# EasyEDA Pro project PCB_v3.3.epro

# Schematic ball_wireless_v3.3
Board Name: ball_wireless_v3.3; Create Date: 2025-08-07; Page Name: Sch; Project Name: CNC_Wireless; Schematic Name: ball_wireless_v3.3; Update Date: 2025-08-07; Company: UTL Lab; Drawn: Long Jun, Chiou; Page Size: A4; Version: v3.3
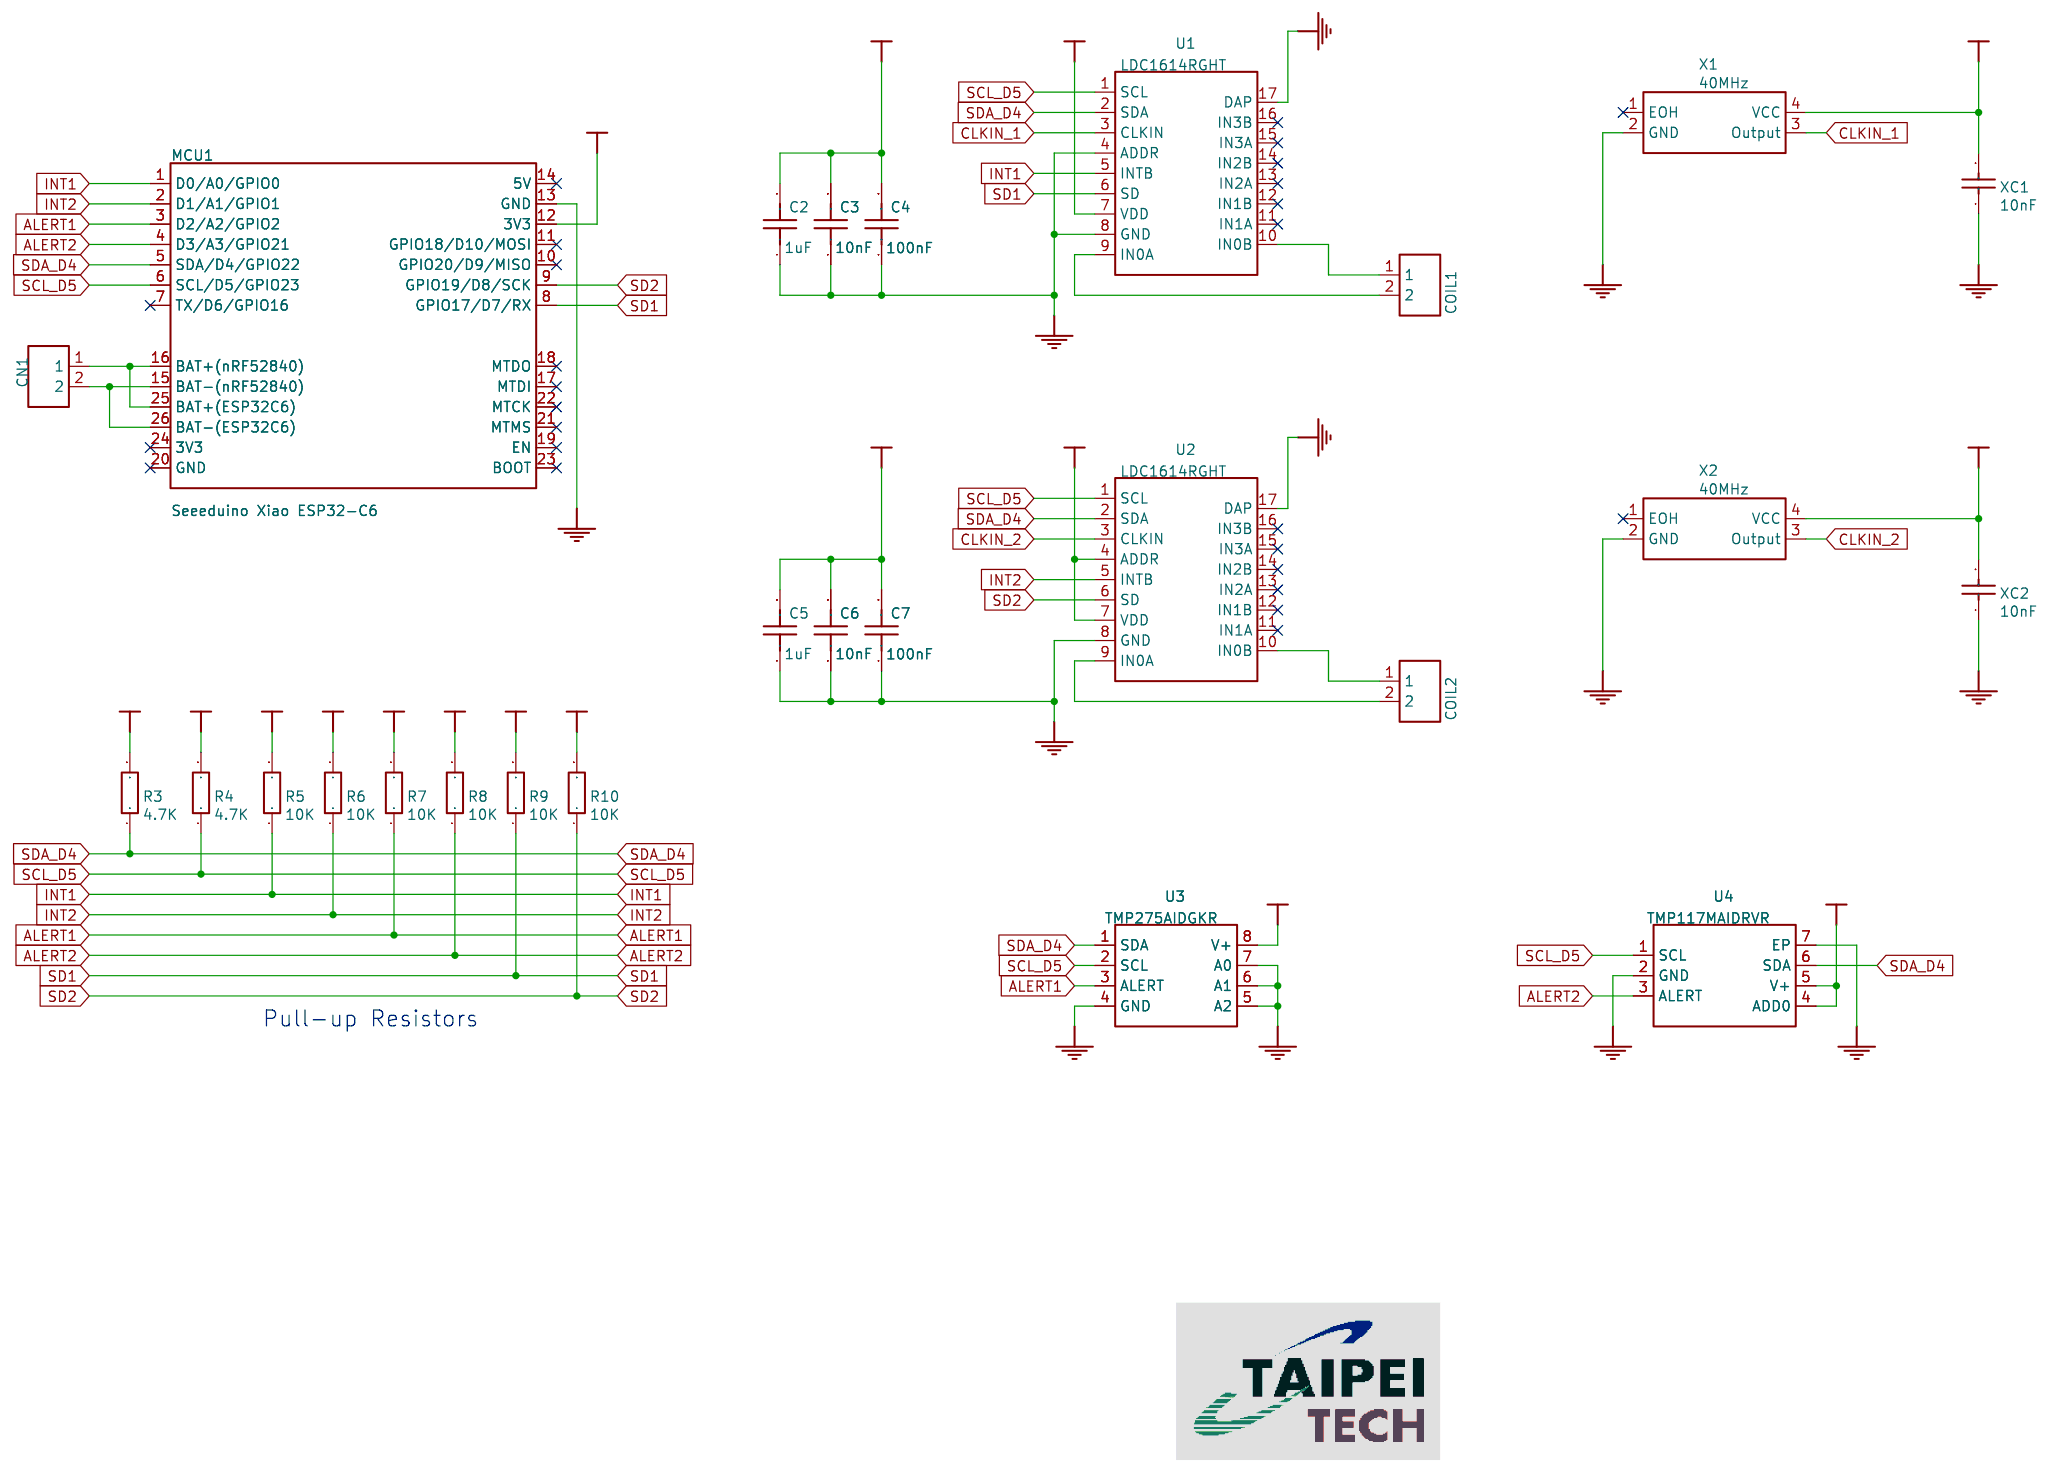
[diagram p0: schematic sheet]

## Parts
C2  1uF  [C0603]
C3  10nF  [C0603]
C4  100nF  [C0603]
C5  1uF  [C0603]
C6  10nF  [C0603]
C7  100nF  [C0603]
CN1  PH2.0-2P  [CONN-TH_PH-2A]
COIL1  UTL_COIL_2  [UTL_CNC_COIL_2]
COIL2  UTL_COIL_2  [UTL_CNC_COIL_2]
MCU1  Seeeduino Xiao ESP32-C6  [SEEEDUINO XIAO ESP32C6/NRF52840(Special)]
R3  4.7K  [R0603]
R4  4.7K  [R0603]
R5  10K  [R0603]
R6  10K  [R0603]
R7  10K  [R0603]
R8  10K  [R0603]
R9  10K  [R0603]
R10  10K  [R0603]
U1  LDC1614RGHT  [WQFN-16_L4.0-W4.0-P0.50-BL-EP2.6]
U2  LDC1614RGHT  [WQFN-16_L4.0-W4.0-P0.50-BL-EP2.6]
U3  TMP275AIDGKR  [VSSOP-8_L3.0-W3.0-P0.65-LS5.0-BL]
U4  TMP117MAIDRVR  [WSON-6_L2.0-W2.0-P0.65-BL-EP]
X1  40MHz  [OSC-SMD_4P-L2.5-W2.0-BL]
X2  40MHz  [OSC-SMD_4P-L2.5-W2.0-BL]
XC1  10nF  [C0603]
XC2  10nF  [C0603]

## Library data of the parts
C2 C5 = 1uF: Supplier: LCSC; Supplier Part: C913754; Manufacturer: muRata(村田); Manufacturer Part: GCM188R11H104KA42D; JLCPCB Part Class: Extended Part; Contributor: LCSC; nameAlias: Value; spicePre: C; spiceSymbolName: GCM188R11H104KA42D
C3 C6 = 10nF: Supplier: LCSC; Supplier Part: C913754; Manufacturer: muRata(村田); Manufacturer Part: GCM188R11H104KA42D; JLCPCB Part Class: Extended Part; Contributor: LCSC; nameAlias: Value; spicePre: C; spiceSymbolName: GCM188R11H104KA42D
C4 C7 = 100nF: Supplier: LCSC; Supplier Part: C913754; Manufacturer: muRata(村田); Manufacturer Part: GCM188R11H104KA42D; JLCPCB Part Class: Extended Part; Contributor: LCSC; nameAlias: Value; spicePre: C; spiceSymbolName: GCM188R11H104KA42D
CN1 = PH2.0-2P: Supplier: LCSC; Supplier Part: C722767; Manufacturer: CAX(创都); Manufacturer Part: PH-2A; JLCPCB Part Class: Extended Part; link: https://lcsc.com/eda_search?q=C722767&%26type=1&ref=editor; Contributor: LCSC; spicePre: C; spiceSymbolName: PH-2A_C722767
COIL1 COIL2 = UTL_COIL_2: Supplier: UTL; Contributor: sunnyair; spicePre: C
MCU1 = Seeeduino Xiao ESP32-C6: Manufacturer: Seeedstudio
R3 R4 = 4.7K: Supplier: LCSC; Manufacturer: YAGEO(国巨); Manufacturer Part: RC0603FR-0710KL; Supplier Part: C98220; JLCPCB Part Class: Extended Part; nameAlias: Value; spicePre: R; spiceSymbolName: RC0603FR-0710KL
R5-R10 = 10K: Supplier: LCSC; Manufacturer: YAGEO(国巨); Manufacturer Part: RC0603FR-0710KL; Supplier Part: C98220; JLCPCB Part Class: Extended Part; nameAlias: Value; spicePre: R; spiceSymbolName: RC0603FR-0710KL
U1 U2 = LDC1614RGHT: Supplier: LCSC; Supplier Part: C2667274; Manufacturer: TI; JLCPCB Part Class: Extended Part; Contributor: sunnyair; spicePre: U
U3 = TMP275AIDGKR: Supplier: LCSC; Supplier Part: C2876440; Manufacturer: null; JLCPCB Part Class: Extended Part; Contributor: LCSC; spicePre: U
U4 = TMP117MAIDRVR: Supplier: Mouser; Supplier Part: 595-TMP117MAIDRVR; Manufacturer: TI(德州仪器); JLCPCB Part Class: Extended Part; Contributor: sunnyair; spicePre: U
X1 X2 = 40MHz: Supplier: LCSC; Supplier Part: C1990951; Manufacturer: CTS(西迪斯); Manufacturer Part: CA25C4005ILT; JLCPCB Part Class: Extended Part; Contributor: lcsc; nameAlias: Value; spicePre: U; spiceSymbolName: CA25C4005ILT
XC1 XC2 = 10nF: Supplier: LCSC; Manufacturer: YAGEO(国巨); Manufacturer Part: CC0603KRX7R9BB103; Supplier Part: C100042; JLCPCB Part Class: Extended Part; nameAlias: Value; spicePre: C; spiceSymbolName: CC0603KRX7R9BB103

## Nets
GND: C2.1 C3.1 C4.1 C5.1 C6.1 C7.1 MCU1.13(GND) U1.4(ADDR) U1.8(GND) U1.17(DAP) U2.8(GND) U2.17(DAP) U3.4(GND) U3.5(A2) U3.6(A1) U3.7(A0) U4.2(GND) U4.7(EP) X1.2(GND) X2.2(GND) XC1.1 XC2.1
VCC: C2.2 C3.2 C4.2 C5.2 C6.2 C7.2 MCU1.12(3V3) R3.2 R4.2 R5.2 R6.2 R7.2 R8.2 R9.2 R10.2 U1.7(VDD) U2.4(ADDR) U2.7(VDD) U3.8(V+) U4.4(ADD0) U4.5(V+) X1.4(VCC) X2.4(VCC) XC1.2 XC2.2
ALERT1: MCU1.3(D2/A2/GPIO2) R7.1 U3.3(ALERT)
ALERT2: MCU1.4(D3/A3/GPIO21) R8.1 U4.3(ALERT)
CLKIN_1: U1.3(CLKIN) X1.3(Output)
CLKIN_2: U2.3(CLKIN) X2.3(Output)
INT1: MCU1.1(D0/A0/GPIO0) R5.1 U1.5(INTB)
INT2: MCU1.2(D1/A1/GPIO1) R6.1 U2.5(INTB)
SCL_D5: MCU1.6(SCL/D5/GPIO23) R4.1 U1.1(SCL) U2.1(SCL) U3.2(SCL) U4.1(SCL)
SD1: MCU1.8(GPIO17/D7/RX) R9.1 U1.6(SD)
SD2: MCU1.9(GPIO19/D8/SCK) R10.1 U2.6(SD)
SDA_D4: MCU1.5(SDA/D4/GPIO22) R3.1 U1.2(SDA) U2.2(SDA) U3.1(SDA) U4.6(SDA)
$1N6: COIL1.2 U1.9(IN0A)
$1N7: COIL1.1 U1.10(IN0B)
$1N21: CN1.2 MCU1.15(BAT-(nRF52840)) MCU1.26(BAT-(ESP32C6))
$1N22: CN1.1 MCU1.16(BAT+(nRF52840)) MCU1.25(BAT+(ESP32C6))
$1N50: COIL2.1 U2.10(IN0B)
$1N51: COIL2.2 U2.9(IN0A)

Not connected (* = marked no-connect by the designer): MCU1 7(TX/D6/GPIO16)* 10(GPIO20/D9/MISO)* 11(GPIO18/D10/MOSI)* 14(5V)* 17(MTDI)* 18(MTDO)* 19(EN)* 20(GND)* 21(MTMS)* 22(MTCK)* 23(BOOT)* 24(3V3)*; U1 11(IN1A)* 12(IN1B)* 13(IN2A)* 14(IN2B)* 15(IN3A)* 16(IN3B)*; U2 11(IN1A)* 12(IN1B)* 13(IN2A)* 14(IN2B)* 15(IN3A)* 16(IN3B)*; X1 1(EOH)*; X2 1(EOH)*

## Notes on the sheet
- Pull-up Resistors

# Board PCB_v3.3
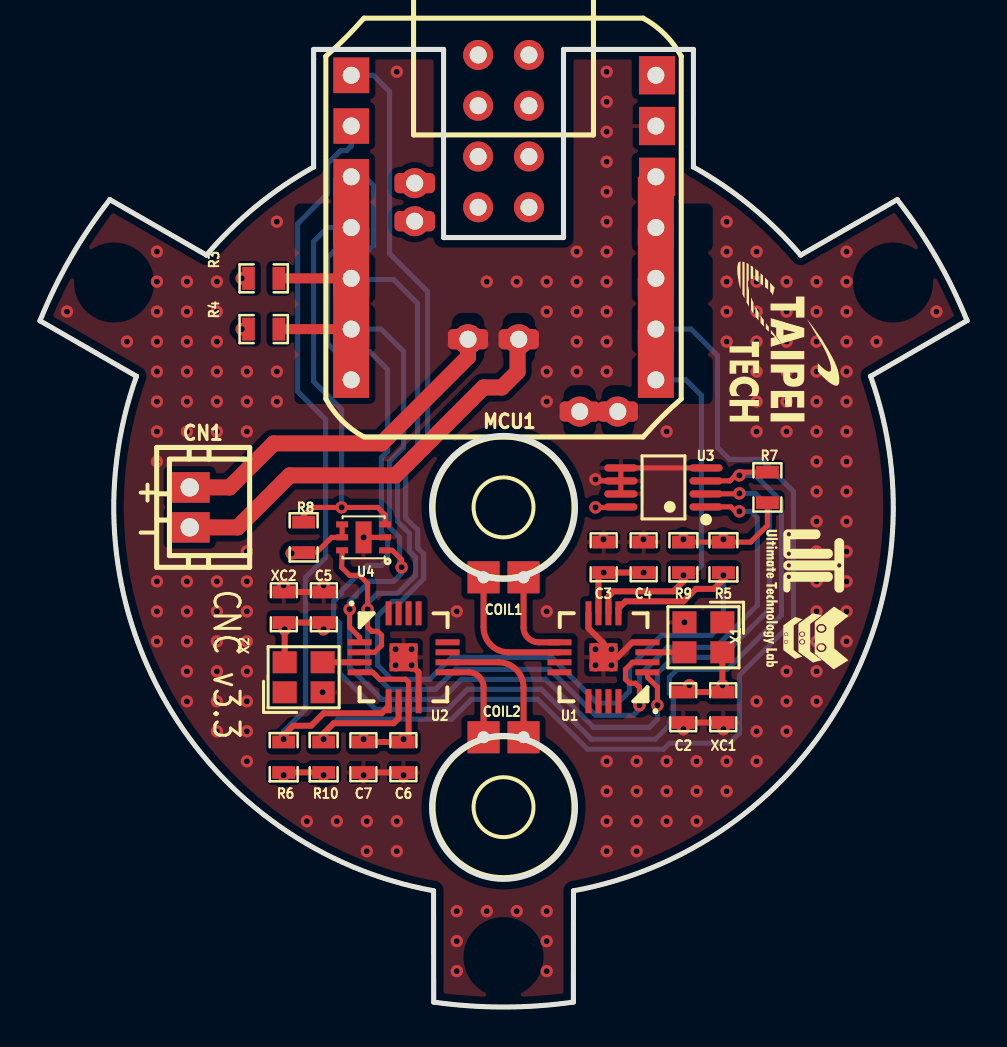
[diagram p1: board, top side]
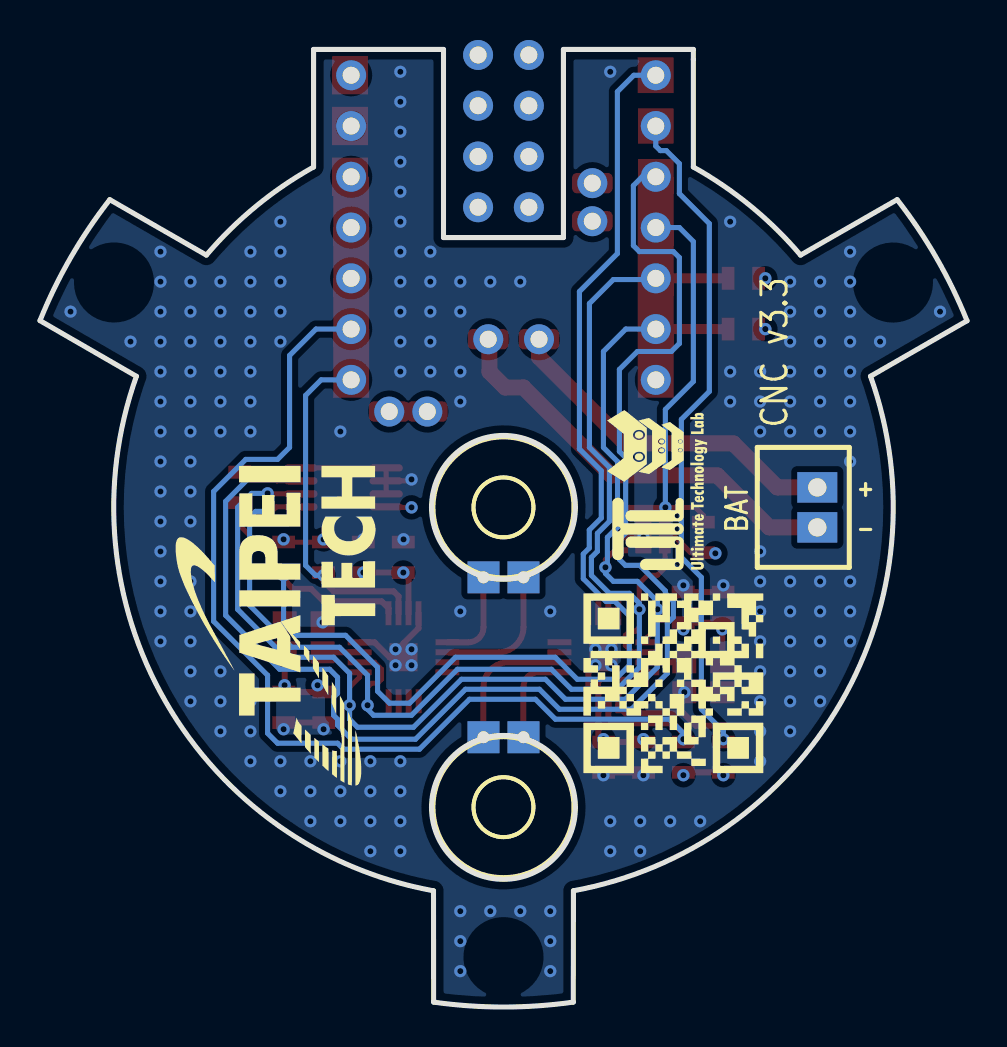
[diagram p2: board, bottom side, seen from below]

Outline 46.38 x 47.91 mm; copper layers: Top Layer, VCC, GND, Bottom Layer. Coordinates in mm from the lower left corner of the outline.
Outline path: circle c23.19,25 r3.6 ; circle c23.19,9.99 r3.6 ; 0,34.34 arc(1.53,37.49) 3.5,40.4 8.33,37.62 arc(10.81,40.07) 13.69,42.03 13.69,47.41 13.69,47.91 20.19,47.91 20.19,38.5 26.19,38.5 26.19,47.91 32.69,47.91 32.69,42.03 arc(35.57,40.07) 38.05,37.62 42.89,40.4 arc(44.85,37.49) 46.38,34.34 41.55,31.56 arc(40.08,15.25) 26.69,5.82 26.68,0.25 arc(23.19,0) 19.7,0.25 19.69,5.82 arc(6.3,15.25) 4.83,31.56 0,34.34
Stack: Top Layer 0.035mm / Dielectric1 0.48mm PP er 4.5 / VCC 0.035mm / Dielectric2 0.48mm FR4 er 4.5 / GND 0.035mm / Dielectric3 0.48mm PP er 4.5 / Bottom Layer 0.035mm

## Design rules (mm)
template: 用户自定义配置
spacing Default (default): track to track 0.152, other pairs 0 to 0.152
track width Default (default): min 0.254, default 0.254, max 25.4
differential pair differentialPair (default): width min 0.127, default 0.254, max 2.54; gap min 0.152, default 0.152
via Default (default): diameter min 0.61, default 0.61, max 100.025; hole min 0.305, default 0.305, max 59.995
pour e1 uses L3
pour e16 uses L2
pour e188 uses L1
pour e345 uses L4

## Placement (name value [footprint] x y rotation side)
C2  1uF  [C0603]  32.19 15 90 top
C3  10nF  [C0603]  28.19 22.5 270 top
C4  100nF  [C0603]  30.19 22.5 270 top
C5  1uF  [C0603]  14.19 20 270 top
C6  10nF  [C0603]  18.19 12.5 90 top
C7  100nF  [C0603]  16.19 12.5 90 top
CN1  PH2.0-2P  [CONN-TH_PH-2A]  7.49 25 270 top
COIL1  UTL_COIL_2  [UTL_CNC_COIL_2]  23.19 25 90 top
COIL2  UTL_COIL_2  [UTL_CNC_COIL_2]  23.19 10 270 top
MCU1  Seeeduino Xiao ESP32-C6  [SEEEDUINO XIAO ESP32C6/NRF52840(Special)]  23.19 39 0 top
R3  4.7K  [R0603]  11.19 36.46 180 top
R4  4.7K  [R0603]  11.19 33.92 180 top
R5  10K  [R0603]  34.19 22.5 90 top
R6  10K  [R0603]  12.19 12.5 270 top
R7  10K  [R0603]  36.39 26 270 top
R8  10K  [R0603]  13.19 23.5 270 top
R9  10K  [R0603]  32.19 22.5 90 top
R10  10K  [R0603]  14.19 12.5 270 top
U1  LDC1614RGHT  [WQFN-16_L4.0-W4.0-P0.50-BL-EP2.6]  28.19 17.5 90 top
U2  LDC1614RGHT  [WQFN-16_L4.0-W4.0-P0.50-BL-EP2.6]  18.19 17.5 270 top
U3  TMP275AIDGKR  [VSSOP-8_L3.0-W3.0-P0.65-LS5.0-BL]  31.19 26 90 top
U4  TMP117MAIDRVR  [WSON-6_L2.0-W2.0-P0.65-BL-EP]  16.19 23.5 90 top
X1  40MHz  [OSC-SMD_4P-L2.5-W2.0-BL]  33.19 18.5 180 top
X2  40MHz  [OSC-SMD_4P-L2.5-W2.0-BL]  13.19 16.5 0 top
XC1  10nF  [C0603]  34.19 15 90 top
XC2  10nF  [C0603]  12.19 20 270 top

## Footprints (pads in the part's own frame, mm; a bottom-side part is the same pattern mirrored in y, then rotated)
C0603
  custom 0.635x1.143 smd: 1(-0.764,0.01) 2(0.76,0.01)
CONN-TH_PH-2A
  rect 1.524x2 hole 0.914: 1(-1,0) 2(1,0)
OSC-SMD_4P-L2.5-W2.0-BL
  rect 1.2x1.1 smd: 1(-0.95,-0.75) 2(0.95,-0.75) 3(0.95,0.75) 4(-0.95,0.75)
R0603
  rect 0.635x1.143 smd: 1(-0.762,0)
  custom 0.635x1.143 smd: 2(0.762,0)
SEEEDUINO XIAO ESP32C6/NRF52840(Special)
  round 1.5 hole 0.85: 1(-7.62,7.62) 2(-7.62,5.08) 3(-7.62,2.54) 4(-7.62,0) 5(-7.62,-2.54) 6(-7.62,-5.08) 7(-7.62,-7.62) 8(7.62,-7.62) 9(7.62,-5.08) 10(7.62,-2.54) 11(7.62,0) 12(7.62,2.54) 13(7.62,5.08) 14(7.62,7.62) 15(-4.445,2.223) 16(-4.445,0.318) 17(-1.27,8.636) 18(1.27,8.636) 19(-1.27,6.096) 20(1.27,6.096) 21(-1.27,3.556) 22(1.27,3.556) 23(-1.27,1.016) 24(1.27,1.016) 25(-1.778,-5.588) 26(0.762,-5.588) 27(3.81,-9.207) 28(5.715,-9.207)
  custom 1.8x1.788 smd: 1(-7.614,7.62)
  custom 1.778x1.778 smd: 2(-7.62,5.08) 3(-7.62,2.54)
  custom 1.8x3.44 smd: 4(-7.62,0) 5(-7.62,-2.54) 6(-7.62,-5.08) 7(-7.62,-7.62) 8(7.62,-7.62) 9(7.62,-5.08) 10(7.62,-2.54) 11(7.62,0)
  custom 1.8x1.916 smd: 12(7.678,2.54)
  custom 1.8x1.915 smd: 13(7.678,5.08)
  custom 1.8x1.913 smd: 14(7.676,7.62)
  custom 2.032x1.016 smd: 15(-4.445,2.223) 16(-4.445,0.318) 25(-1.778,-5.588) 26(0.762,-5.588) 27(3.81,-9.207) 28(5.715,-9.207)
UTL_CNC_COIL_2
  rect 1.6x1.6 hole 0.6: 1(-3.5,1) 2(-3.5,-1)
VSSOP-8_L3.0-W3.0-P0.65-LS5.0-BL
  oval 0.364x1.662 smd: 1(-0.975,-2.131) 2(-0.325,-2.131) 3(0.325,-2.131) 4(0.975,-2.131) 5(0.975,2.131) 6(0.325,2.131) 7(-0.325,2.131) 8(-0.975,2.131)
WQFN-16_L4.0-W4.0-P0.50-BL-EP2.6
  rect 0.3x1.2 smd: 1(-0.75,-2.2) 2(-0.25,-2.2) 3(0.25,-2.2) 4(0.75,-2.2) 9(0.75,2.2) 10(0.25,2.2) 11(-0.25,2.2) 12(-0.75,2.2)
  rect 1.2x0.3 smd: 5(2.2,-0.75) 6(2.2,-0.25) 7(2.2,0.25) 8(2.2,0.75) 13(-2.2,0.75) 14(-2.2,0.25) 15(-2.2,-0.25) 16(-2.2,-0.75)
  rect 1.4x1.4 smd: 17(0,0)
WSON-6_L2.0-W2.0-P0.65-BL-EP
  rect 0.3x0.6 smd: 1(-0.65,-1.075) 2(0,-1.075) 3(0.65,-1.075) 4(0.65,1.075) 5(0,1.075) 6(-0.65,1.075)
  rect 1.6x0.8 smd: 7(0,0)

## Nets
As in the schematic.

Pads without a net: MCU1 7 10 11 14 17 18 19 20 21 22 23 24 27 28; U1 11 12 13 14 15 16; U2 11 12 13 14 15 16; X1 1; X2 1

## Via types
v1: diameter 0.61, hole 0.305, Top Layer to Bottom Layer, 161 vias
v2: diameter 0.62, hole 0.31, Top Layer to Bottom Layer, 49 vias

## Routing (per net, layer and track width the routed paths; a pad name or vN(x,y) marks a point on that pad's centre or on a via; arc(x,y) is an arc through that point)
GND: length 21.6
  Top Layer w0.254: U3.7 U3.6 ; U3.6 27.87,26.32 v2(27.79,26.4) ; U3.6 U3.5 U3.4 ; U4.2 v2(16.19,23.5)
  Top Layer w0.3: 18.19,11.6 18.19,11.74 C7.1 ; C2.1 XC1.1 ; U2.17 v2(18.59,17.1) 18.94,16.75 U2.8 ; 30.39,18.25 29.64,18.25 28.89,17.5 28.19,17.5 28.19,18.2 27.44,18.95 U1.8 ; XC2.1 C5.1
  vias: v1(1.35,34.8) v1(4.35,33.3) v1(5.85,37.8) v1(5.85,36.3) v1(5.85,34.8) v1(5.85,33.3) v1(5.85,31.8) v1(5.85,30.3) v1(5.85,28.8) v1(5.85,27.3) v1(5.85,21.3) v1(5.85,19.8) v1(5.85,18.3) v1(7.35,36.3) v1(7.35,34.8) v1(7.35,33.3) v1(7.35,31.8) v1(7.35,30.3) v1(7.35,28.8) v1(7.35,21.3) v1(7.35,19.8) v1(7.35,18.3) v1(7.35,16.8) v1(7.35,15.3) v1(8.85,36.3) v1(8.85,34.8) v1(8.85,33.3) v1(8.85,31.8) v1(8.85,30.3) v1(8.85,28.8) v1(8.85,21.3) v1(8.85,19.8) v1(8.85,18.3) v1(8.85,16.8) v1(8.85,15.3) v1(8.85,13.8) v1(10.35,31.8) v1(10.35,30.3) v1(10.35,28.8) v1(10.35,22.8) v1(10.35,21.3) v1(10.35,19.8) v1(10.35,18.3) v1(10.35,16.8) v1(10.35,15.3) v1(10.35,13.8) v1(10.35,12.3) v1(11.85,39.3) v1(11.85,31.8) v1(11.85,30.3) v1(13.35,9.3) v1(14.85,9.3) v1(16.35,9.3) v1(16.35,7.8) v1(17.85,46.8) v1(17.85,9.3) v1(17.85,7.8) v1(20.85,19.8) v1(20.85,4.8) v1(20.85,3.3) v1(20.85,1.8) v1(22.35,36.3) v1(22.35,4.8) v1(23.85,36.3) v1(23.85,4.8) v1(25.35,36.3) v1(25.35,34.8) v1(25.35,31.8) v1(25.35,30.3) v1(25.35,19.8) v1(25.35,4.8) v1(25.35,3.3) v1(25.35,1.8) v1(26.85,37.8) v1(26.85,36.3) v1(26.85,34.8) v1(26.85,33.3) v1(26.85,31.8) v1(28.35,46.8) v1(28.35,45.3) v1(28.35,43.8) v1(28.35,42.3) v1(28.35,40.8) v1(28.35,39.3) v1(28.35,37.8) v1(28.35,36.3) v1(28.35,34.8) v1(28.35,33.3) v1(28.35,31.8) v1(28.35,12.3) v1(28.35,10.8) v1(28.35,9.3) v1(28.35,7.8) v1(29.85,12.3) v1(29.85,10.8) v1(29.85,9.3) v1(29.85,7.8) v1(31.35,28.8) v1(31.35,12.3) v1(31.35,10.8) v1(31.35,9.3) v1(32.85,12.3) v1(32.85,10.8) v1(32.85,9.3) v1(34.35,39.3) v1(34.35,37.8) v1(34.35,36.3) v1(34.35,34.8) v1(34.35,33.3) v1(34.35,12.3) v1(34.35,10.8) v1(35.85,37.8) v1(35.85,36.3) v1(35.85,34.8) v1(35.85,33.3) v1(35.85,31.8) v1(35.85,30.3) v1(35.85,28.8) v1(35.85,15.3) v1(35.85,13.8) v1(35.85,12.3) v1(37.35,36.3) v1(37.35,34.8) v1(37.35,33.3) v1(37.35,31.8) v1(37.35,30.3) v1(37.35,28.8) v1(37.35,16.8) v1(37.35,15.3) v1(37.35,13.8) v1(38.85,36.3) v1(38.85,34.8) v1(38.85,33.3) v1(38.85,31.8) v1(38.85,30.3) v1(38.85,28.8) v1(38.85,27.3) v1(38.85,25.8) v1(38.85,24.3) v1(38.85,22.8) v1(38.85,21.3) v1(38.85,19.8) v1(38.85,18.3) v1(38.85,16.8) v1(38.85,15.3) v1(40.35,37.8) v1(40.35,36.3) v1(40.35,34.8) v1(40.35,33.3) v1(40.35,31.8) v1(40.35,30.3) v1(40.35,28.8) v1(40.35,27.3) v1(40.35,25.8) v1(40.35,24.3) v1(40.35,22.8) v1(40.35,21.3) v1(40.35,19.8) v1(40.35,18.3) v1(41.85,33.3) v1(44.85,34.8) v2(12.19,21.1) v2(14.14,15.75) v2(14.19,21.1) v2(16.19,11.6) v2(17.79,17.9) v2(17.79,17.1) v2(18.19,11.6) v2(18.59,17.9) v2(27.79,17.9) v2(27.79,17.1) v2(28.19,23.4) v2(28.59,17.9) v2(28.59,17.1) v2(30.19,23.4) v2(32.19,13.9) v2(32.24,19.25) v2(34.19,13.9)
VCC: length 32.1
  Top Layer w0.254: U3.8 29.03,25 v2(27.79,25) ; v2(34.19,23.4) 34.05,23.26 R9.2 ; 36.39,25.24 36.39,24.1 35.55,23.26 34.19,23.26 ; U2.7 18.44,16.25 18.29,16.4 16.99,16.4 16.64,16.75 U2.4 ; 15.12,23.5 14.59,23.5 13.83,22.74 13.19,22.74 ; U4.4 U4.5
  Top Layer w0.3: U1.7 27.94,21.48 v2(28.2,21.74) v2(30.2,21.74) ; v2(16.19,13.4) 16.19,13.26 C6.2 18.18,13.39 v2(18.19,13.4) 18.44,13.65 U2.7 ; X2.4 v2(12.24,18.9) 12.24,19.2 XC2.2 C5.2 ; 14.19,11.74 12.19,11.74 v2(12.19,11.6) ; X1.4 34.14,15.8 XC1.2 32.49,15.76 v2(32.49,16.1)
  vias: v2(10.09,36.46) v2(10.09,33.92) v2(12.59,22.7) v2(14.19,18.9) v2(14.19,11.6) v2(32.19,23.4) v2(34.14,16.1)
ALERT1: length 71.8
  Top Layer w0.254: R7.1 35.15,26.76 v2(34.99,26.6) 34.79,26.6 34.52,26.33 33.32,26.33
  Bottom Layer w0.254: v2(34.99,26.6) 35.79,26.6 37.09,25.3 37.09,19.6 34.39,16.9 31.89,16.9 31.49,16.5 31.49,15.7 31.69,15.5 31.69,14.6 31.49,14.4 31.49,14.1 30.79,13.4 27.59,13.4 25.09,15.9 21.39,15.9 20.39,14.9 16.79,14.9 14.99,16.7 14.99,19.2 14.69,19.5 14.69,20.3 15.09,20.7 15.09,20.82 16.37,22.1 17.09,22.1 17.39,22.4 17.39,23.4 17.08,23.71 17.08,27.49 17.39,27.8 17.39,31.9 16.49,32.8 14.79,32.8 14.39,33.2 14.39,37.5 14.69,37.8 16.39,37.8 16.69,38.1 16.69,41.1 16.25,41.54 15.57,41.54
ALERT2: length 21.3
  Top Layer w0.254: 13.19,24.26 13.19,24.6 13.59,25 v2(15.09,25) 16.89,25 17.27,24.62 17.27,24.15
  Bottom Layer w0.254: MCU1.4 14.39,39 13.69,38.3 13.69,31.3 15.09,29.9 v2(15.09,25)
CLKIN_1: length 1.9
  Top Layer w0.3: X1.3 U1.3
CLKIN_2: length 1.9
  Top Layer w0.3: X2.3 U2.3
INT1: length 64
  Top Layer w0.3: 34.19,21.74 34.19,21.4 33.72,20.92 32.81,20.92 32.19,20.3 29.29,20.3 28.94,19.95 U1.5
  Bottom Layer w0.254: v2(34.19,21.6) 34.19,19.2 33.59,18.6 31.09,18.6 29.49,17 29.49,15.8 28.89,15.2 27.89,15.2 25.59,17.5 20.6,17.5 19.5,16.4 17.59,16.4 16.89,17.1 16.89,19.57 17.62,20.29 18.06,20.29 19.2,21.43 19.2,22.67 18.9,22.97 18.9,23.87 18.3,24.47 18.3,26.83 19.39,27.93 19.39,35.8 17.49,37.7 17.49,45.8 16.67,46.62 15.57,46.62
INT2: length 39.9
  Top Layer w0.3: U2.5 17.44,15.05 17.09,14.7 14.19,14.7 13.57,14.07 12.66,14.07 12.19,13.6 R6.1
  Bottom Layer w0.254: MCU1.2 15.57,43.08 15.34,42.85 15.04,42.85 14.39,42.2 14.39,40.7 12.89,39.2 12.89,30.8 14.29,29.4 14.29,22.5 13.29,21.5 13.29,14.9 12.19,13.8 v2(12.19,13.4)
SCL_D5: length 65.4
  Top Layer w0.254: v2(15.49,19.9) 15.49,19 15.99,18.5 U2.1 ; U1.1 30.39,16.5 30.89,16 v2(30.89,15.1) ; v2(34.99,25.7) 34.97,25.68 U3.2 ; U4.1 17.63,22.85 18.09,22.38 v2(18.09,22)
  Top Layer w0.5: R4.1 MCU1.6
  Bottom Layer w0.254: v2(34.99,25.7) 35.79,25.7 36.49,25 36.49,19.9 34.09,17.5 31.69,17.5 30.89,16.7 30.89,14.4 30.49,14 27.69,14 25.29,16.4 21.09,16.4 20.09,15.4 17.09,15.4 15.49,17 15.49,20.3 16.49,21.3 17.69,21.3 18.09,21.7 v2(18.09,22) 17.99,22.1 17.99,23.5 17.49,24.01 17.49,27.29 18.19,28 18.19,32.8 17.07,33.92 MCU1.6
SD1: length 17.6
  Top Layer w0.3: 32.19,21.74 32.19,21.3 31.69,20.8 28.69,20.8 28.44,20.55 U1.6
  Bottom Layer w0.254: v2(32.19,21.6) 32.59,21.6 33.09,22.1 33.09,30.6 32.31,31.38 MCU1.8
SD2: length 54.7
  Top Layer w0.3: R10.1 14.19,13.7 14.69,14.2 17.69,14.2 17.94,14.45 U2.6
  Bottom Layer w0.254: MCU1.9 32.57,33.92 33.89,32.6 33.89,28 34.49,27.4 36.08,27.4 37.69,25.79 37.69,19.3 34.99,16.6 34.99,13.7 34.49,13.2 31.49,13.2 31.19,12.9 27.39,12.9 24.89,15.4 21.59,15.4 20.59,14.4 14.89,14.4 14.19,13.7 v2(14.19,13.4)
SDA_D4: length 70.6
  Top Layer w0.254: v2(29.99,15.1) 29.99,16 29.79,16.2 29.49,16.2 29.29,16.4 29.29,16.9 29.64,17.25 30.39,17.25 ; U2.2 16.74,17.75 17.09,18.1 17.09,18.6 16.89,18.8 16.59,18.8 16.39,19 v2(16.39,19.9) 16.39,21.2 15.99,21.6 15.49,21.6 15.09,22 15.12,22.85 ; v2(34.99,24.8) 34.79,24.8 34.56,25.03 33.32,25.03
  Top Layer w0.5: R3.1 MCU1.5
  Bottom Layer w0.254: MCU1.5 15.63,36.4 17.69,36.4 18.89,35.2 18.89,28 17.89,27 17.89,24.3 18.49,23.7 18.49,22.8 18.79,22.5 18.79,21.6 17.89,20.7 16.89,20.7 16.39,20.2 v2(16.39,19.9) 16.39,17 17.49,15.9 19.79,15.9 20.79,16.9 25.49,16.9 27.79,14.6 29.69,14.6 29.99,14.9 v2(29.99,15.1) 29.99,16.6 31.39,18 33.79,18 35.89,20.1 35.89,24.5 35.59,24.8 v2(34.99,24.8)
$1N6: length 4.7
  Top Layer w0.3: COIL1.2 24.19,19 arc(24.41,18.47) 24.94,18.25 ; 24.94,18.25 25.99,18.25
$1N7: length 7
  Top Layer w0.3: 23.44,17.75 25.99,17.75 ; COIL1.1 22.19,19 arc(22.56,18.12) 23.44,17.75
$1N21: length 39
  Top Layer w0.8: 23.95,33.41 23.89,33.35 23.89,31.78 23.11,31 22.19,31 17.79,26.6 12.49,26.6 9.89,24 CN1.2
  VCC w1: 23.95,33.41 23.99,33.37 23.99,32.1 22.99,31.1 20.49,31.1 19.49,32.1 19.49,34.5 17.19,36.8 17.19,40.3 18.11,41.22 MCU1.15
$1N22: length 24.5
  Top Layer w0.8: 7.49,26 9.49,26 11.69,28.2 17.09,28.2 21.41,32.52 21.41,33.41
  VCC w1: MCU1.16 18.75,37.34 21.41,34.68 21.41,33.41
$1N50: length 7
  Top Layer w0.3: COIL2.1 24.19,16 arc(23.82,16.88) 22.94,17.25 U2.10
$1N51: length 4.7
  Top Layer w0.3: 21.44,16.75 U2.9 ; COIL2.2 22.19,16 arc(21.97,16.53) 21.44,16.75

## Copper pours and planes (outline as drawn; the poured copper is in the pictures)
GND on Top Layer: -3.81,53.1 48.19,53.1 48.19,-1.9 -3.81,-1.9
GND on Bottom Layer: -4.61,53.7 49.39,53.7 49.39,-3.3 -4.61,-3.3
GND on GND: -6.81,56 51.19,56 51.19,-5 -6.81,-5
VCC on VCC: -5.81,55 50.19,55 50.19,-4 -5.81,-4

## Text on the board
Bottom Silkscreen Layer: + | - | BAT | CNC v3.3
Top Silkscreen Layer: + | - | CNC v3.3
